# Altium schematic sheet 05_FPGA_A.SchDoc: FPGA Part A: Bank 1-2
size 381 x 266 mm; Organization: Meteroi; Address1: Room 428, 410 Guiping Rd.; Address2: Shanghai 200233, CHINA; SheetNumber: 6; SheetTotal: 11; PageSetup: Record=PageOptions|CenterHorizontal=True|CenterVertical=True|PrintScale=0.75|XCorrection=1.00|YCorrection=1.00|PrintKind=2|BorderSize=5000000|LeftOffset=0|BottomOffset=0|Orientation=2|PaperLength=1000|PaperWidth=1000|Scale=100|PaperSource=276|PrintQuality=-3|MediaType=1|DitherType=10|PaperKind=A4|PrintScaleMode=1
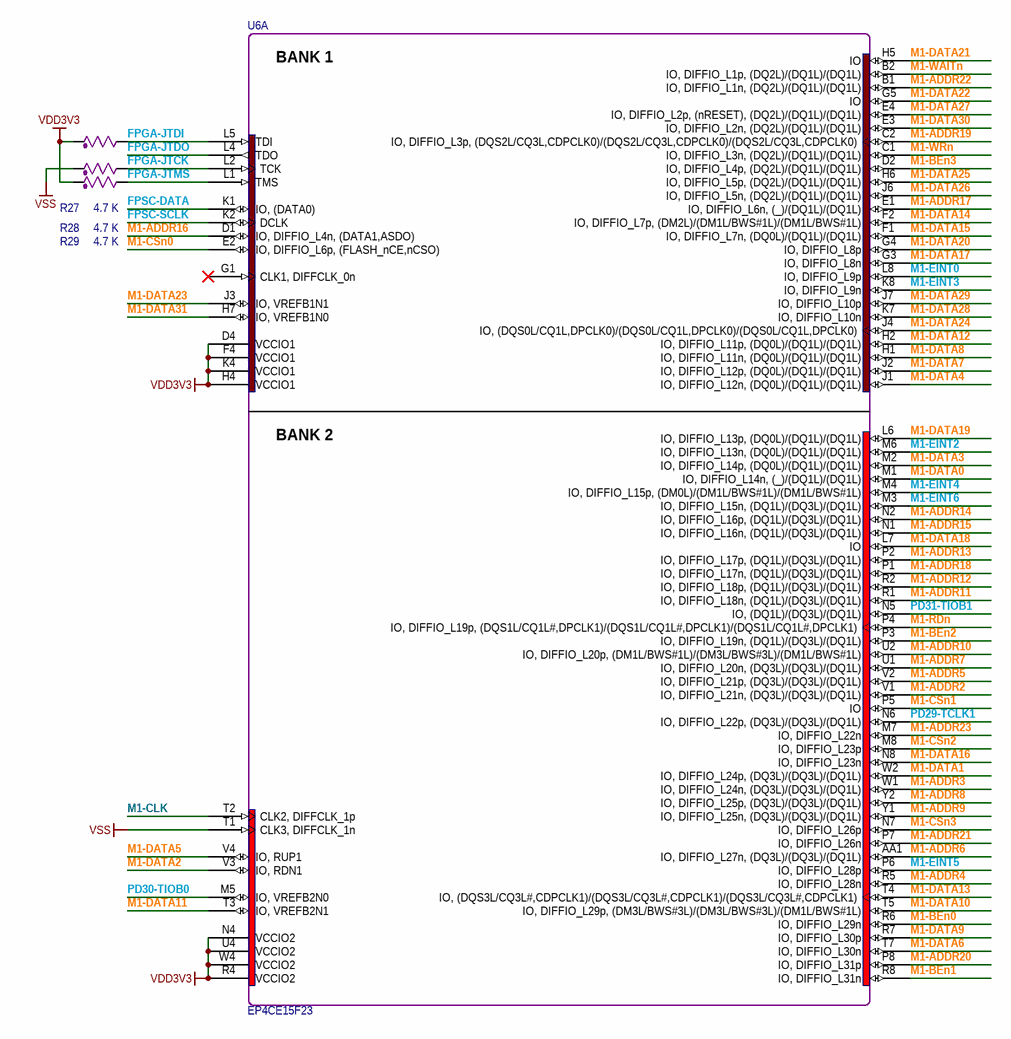
[diagram p0: 05_FPGA_A.SchDoc]

## Parts
R27  4.7 K  [0402A2]
R28  4.7 K  [0402A2]
R29  4.7 K  [0402A2]
U6  EP4CE15F23  [FBGA-484]  (part A of 5)

## Nets
VDD3V3: R27.2 R29.2 U6.D4(VCCIO1) U6.F4(VCCIO1) U6.H4(VCCIO1) U6.K4(VCCIO1) U6.N4(VCCIO2) U6.R4(VCCIO2) U6.U4(VCCIO2) U6.W4(VCCIO2)
VSS: R28.2 U6.T1(CLK3,_DIFFCLK_1n)
FPGA-JTCK: R28.1 U6.L2(TCK)
FPGA-JTDI: R27.1 U6.L5(TDI)
FPGA-JTDO: U6.L4(TDO)
FPGA-JTMS: R29.1 U6.L1(TMS)
FPSC-DATA: U6.K1(IO,_(DATA0))
FPSC-SCLK: U6.K2(DCLK)
M1-ADDR2: U6.V1(IO,_DIFFIO_L21n,_(DQ3L)/(DQ3L)/(DQ1L))
M1-ADDR3: U6.W1(IO,_DIFFIO_L24n,_(DQ3L)/(DQ3L)/(DQ1L))
M1-ADDR4: U6.R5(IO,_DIFFIO_L28n)
M1-ADDR5: U6.V2(IO,_DIFFIO_L21p,_(DQ3L)/(DQ3L)/(DQ1L))
M1-ADDR6: U6.AA1(IO,_DIFFIO_L27n,_(DQ3L)/(DQ3L)/(DQ1L))
M1-ADDR7: U6.U1(IO,_DIFFIO_L20n,_(DQ3L)/(DQ3L)/(DQ1L))
M1-ADDR8: U6.Y2(IO,_DIFFIO_L25p,_(DQ3L)/(DQ3L)/(DQ1L))
M1-ADDR9: U6.Y1(IO,_DIFFIO_L25n,_(DQ3L)/(DQ3L)/(DQ1L))
M1-ADDR10: U6.U2(IO,_DIFFIO_L20p,_(DM1L/BWS#1L)/(DM3L/BWS#3L)/(DM1L/BWS#1L))
M1-ADDR11: U6.R1(IO,_DIFFIO_L18n,_(DQ1L)/(DQ3L)/(DQ1L))
M1-ADDR12: U6.R2(IO,_DIFFIO_L18p,_(DQ1L)/(DQ3L)/(DQ1L))
M1-ADDR13: U6.P2(IO,_DIFFIO_L17p,_(DQ1L)/(DQ3L)/(DQ1L))
M1-ADDR14: U6.N2(IO,_DIFFIO_L16p,_(DQ1L)/(DQ3L)/(DQ1L))
M1-ADDR15: U6.N1(IO,_DIFFIO_L16n,_(DQ1L)/(DQ3L)/(DQ1L))
M1-ADDR16: U6.D1(IO,_DIFFIO_L4n,_(DATA1,ASDO))
M1-ADDR17: U6.E1(IO,_DIFFIO_L6n,_(_)/(DQ1L)/(DQ1L))
M1-ADDR18: U6.P1(IO,_DIFFIO_L17n,_(DQ1L)/(DQ3L)/(DQ1L))
M1-ADDR19: U6.C2(IO,_DIFFIO_L3p,_(DQS2L/CQ3L,CDPCLK0)/(DQS2L/CQ3L,CDPCLK0)/(DQS2L/CQ3L,CDPCLK0))
M1-ADDR20: U6.P8(IO,_DIFFIO_L31p)
M1-ADDR21: U6.P7(IO,_DIFFIO_L26n)
M1-ADDR22: U6.B1(IO,_DIFFIO_L1n,_(DQ2L)/(DQ1L)/(DQ1L))
M1-ADDR23: U6.M7(IO,_DIFFIO_L22n)
M1-BEn0: U6.R6(IO,_DIFFIO_L29n)
M1-BEn1: U6.R8(IO,_DIFFIO_L31n)
M1-BEn2: U6.P3(IO,_DIFFIO_L19n,_(DQ1L)/(DQ3L)/(DQ1L))
M1-BEn3: U6.D2(IO,_DIFFIO_L4p,_(DQ2L)/(DQ1L)/(DQ1L))
M1-CLK: U6.T2(CLK2,_DIFFCLK_1p)
M1-CSn0: U6.E2(IO,_DIFFIO_L6p,_(FLASH_nCE,nCSO))
M1-CSn1: U6.P5(IO)
M1-CSn2: U6.M8(IO,_DIFFIO_L23p)
M1-CSn3: U6.N7(IO,_DIFFIO_L26p)
M1-DATA0: U6.M1(IO,_DIFFIO_L14n,_(_)/(DQ1L)/(DQ1L))
M1-DATA1: U6.W2(IO,_DIFFIO_L24p,_(DQ3L)/(DQ3L)/(DQ1L))
M1-DATA2: U6.V3(IO,_RDN1)
M1-DATA3: U6.M2(IO,_DIFFIO_L14p,_(DQ0L)/(DQ1L)/(DQ1L))
M1-DATA4: U6.J1(IO,_DIFFIO_L12n,_(DQ0L)/(DQ1L)/(DQ1L))
M1-DATA5: U6.V4(IO,_RUP1)
M1-DATA6: U6.T7(IO,_DIFFIO_L30n)
M1-DATA7: U6.J2(IO,_DIFFIO_L12p,_(DQ0L)/(DQ1L)/(DQ1L))
M1-DATA8: U6.H1(IO,_DIFFIO_L11n,_(DQ0L)/(DQ1L)/(DQ1L))
M1-DATA9: U6.R7(IO,_DIFFIO_L30p)
M1-DATA10: U6.T5(IO,_DIFFIO_L29p,_(DM3L/BWS#3L)/(DM3L/BWS#3L)/(DM1L/BWS#1L))
M1-DATA11: U6.T3(IO,_VREFB2N1)
M1-DATA12: U6.H2(IO,_DIFFIO_L11p,_(DQ0L)/(DQ1L)/(DQ1L))
M1-DATA13: U6.T4(IO,_(DQS3L/CQ3L#,CDPCLK1)/(DQS3L/CQ3L#,CDPCLK1)/(DQS3L/CQ3L#,CDPCLK1))
M1-DATA14: U6.F2(IO,_DIFFIO_L7p,_(DM2L)/(DM1L/BWS#1L)/(DM1L/BWS#1L))
M1-DATA15: U6.F1(IO,_DIFFIO_L7n,_(DQ0L)/(DQ1L)/(DQ1L))
M1-DATA16: U6.N8(IO,_DIFFIO_L23n)
M1-DATA17: U6.G3(IO,_DIFFIO_L8n)
M1-DATA18: U6.L7(IO)
M1-DATA19: U6.L6(IO,_DIFFIO_L13p,_(DQ0L)/(DQ1L)/(DQ1L))
M1-DATA20: U6.G4(IO,_DIFFIO_L8p)
M1-DATA21: U6.H5(IO)
M1-DATA22: U6.G5(IO)
M1-DATA23: U6.J3(IO,_VREFB1N1)
M1-DATA24: U6.J4(IO,_(DQS0L/CQ1L,DPCLK0)/(DQS0L/CQ1L,DPCLK0)/(DQS0L/CQ1L,DPCLK0))
M1-DATA25: U6.H6(IO,_DIFFIO_L5p,_(DQ2L)/(DQ1L)/(DQ1L))
M1-DATA26: U6.J6(IO,_DIFFIO_L5n,_(DQ2L)/(DQ1L)/(DQ1L))
M1-DATA27: U6.E4(IO,_DIFFIO_L2p,_(nRESET),_(DQ2L)/(DQ1L)/(DQ1L))
M1-DATA28: U6.K7(IO,_DIFFIO_L10n)
M1-DATA29: U6.J7(IO,_DIFFIO_L10p)
M1-DATA30: U6.E3(IO,_DIFFIO_L2n,_(DQ2L)/(DQ1L)/(DQ1L))
M1-DATA31: U6.H7(IO,_VREFB1N0)
M1-EINT0: U6.L8(IO,_DIFFIO_L9p)
M1-EINT2: U6.M6(IO,_DIFFIO_L13n,_(DQ0L)/(DQ1L)/(DQ1L))
M1-EINT3: U6.K8(IO,_DIFFIO_L9n)
M1-EINT4: U6.M4(IO,_DIFFIO_L15p,_(DM0L)/(DM1L/BWS#1L)/(DM1L/BWS#1L))
M1-EINT5: U6.P6(IO,_DIFFIO_L28p)
M1-EINT6: U6.M3(IO,_DIFFIO_L15n,_(DQ1L)/(DQ3L)/(DQ1L))
M1-RDn: U6.P4(IO,_DIFFIO_L19p,_(DQS1L/CQ1L#,DPCLK1)/(DQS1L/CQ1L#,DPCLK1)/(DQS1L/CQ1L#,DPCLK1))
M1-WAITn: U6.B2(IO,_DIFFIO_L1p,_(DQ2L)/(DQ1L)/(DQ1L))
M1-WRn: U6.C1(IO,_DIFFIO_L3n,_(DQ2L)/(DQ1L)/(DQ1L))
PD29-TCLK1: U6.N6(IO,_DIFFIO_L22p,_(DQ3L)/(DQ3L)/(DQ1L))
PD30-TIOB0: U6.M5(IO,_VREFB2N0)
PD31-TIOB1: U6.N5(IO,_(DQ1L)/(DQ3L)/(DQ1L))

Not connected (* = marked no-connect by the designer): U6 G1(CLK1,_DIFFCLK_0n)*

## Notes on the sheet
- Title:
- Project:
- Sheet:
- Of
- Size:
- D/N:
- Rev:
- Date:
- P/N:
- S/N:
- Designer:
- C
- (in symbol EP4CE15F23, part A) BANK 1; BANK 2

## Library data of the parts
R27-R29 = RES: Normal Resistor; PartNumber: 0; Vendor: KOA; Designer: shyul; PinCountSMD: 2; SerialNumber: 0; Value: 4.7 K; Version: 1.0; VersionDate: 04-27-2011; PCBMarker: Resistor; Publisher: Cowin; PinCountHole: 0
U6 = EP4CE15F23: Cyclone IV EP4CE15F23 FPGA; PartNumber: EP4CE15F23C8N; SerialNumber: 0; Vendor: Altera; Designer: shyul; PCBMarker: FPGA; Version: 1.0; VersionDate: 2-17-2012; Value: EP4CE15F23; Publisher: Cowin